# Altium schematic sheet ESP32-HWE-Dev-I2C.SchDoc
size A4; SheetNumber: 1; SheetTotal: 4
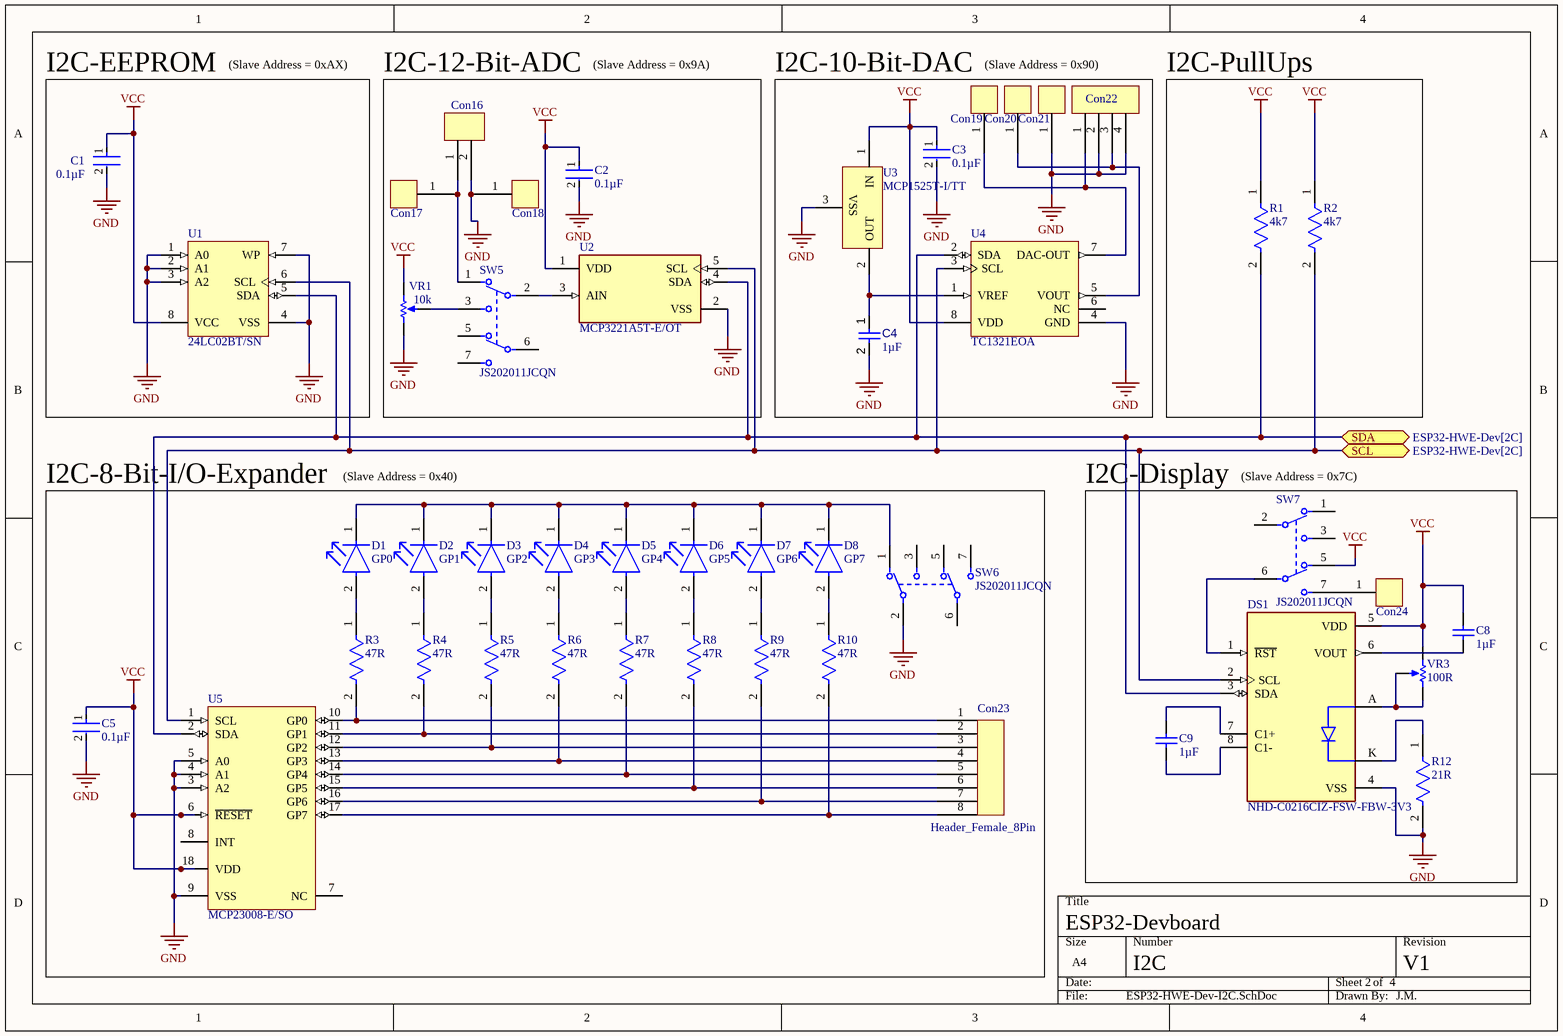
[diagram p0: ESP32-HWE-Dev-I2C.SchDoc]

## Parts
C1  0.1µF  [FP-0805-L_2_01_0_2-W_1_25-IPC_C]
C2  0.1µF  [FP-0805-L_2_01_0_2-W_1_25-IPC_C]
C3  0.1µF  [FP-0805-L_2_01_0_2-W_1_25-IPC_C]
C4  value 1µF  [CAPC2013X135X45NL10T25]  (hidden comment: Capacitor 1 uF +/- 10% 50 V 0805)
C5  0.1µF  [FP-0805-L_2_01_0_2-W_1_25-IPC_C]
C8  1µF  [CAPC2013X145X50LL20T25]
C9  1µF  [CAPC2013X145X50LL20T25]
Con16  Female 2 Pin  [Header_Female_2Pin]  (value not drawn)
Con17  Solder Nail RTM 1.3  [Solder_Nail_RTM_1.3]  (value not drawn)
Con18  Solder Nail RTM 1.3  [Solder_Nail_RTM_1.3]  (value not drawn)
Con19  I2C-DAC-DAC-Out  [Solder_Nail_RTM_1.3]  (value not drawn)
Con20  I2C-DAC-Vout  [Solder_Nail_RTM_1.3]  (value not drawn)
Con21  DAC-GND  [Solder_Nail_RTM_1.3]  (value not drawn)
Con22  Female 4 Pin  [Header_Female_4Pin]  (value not drawn)
Con23  Header_Female_8Pin  [Header_Female_8Pin]
Con24  Solder Nail RTM 1.3  [Solder_Nail_RTM_1.3]  (value not drawn)
D1  GP0  [FP-SML-LXT0805IW-TR-MFG]
D2  GP1  [FP-SML-LXT0805IW-TR-MFG]
D3  GP2  [FP-SML-LXT0805IW-TR-MFG]
D4  GP3  [FP-SML-LXT0805IW-TR-MFG]
D5  GP4  [FP-SML-LXT0805IW-TR-MFG]
D6  GP5  [FP-SML-LXT0805IW-TR-MFG]
D7  GP6  [FP-SML-LXT0805IW-TR-MFG]
D8  GP7  [FP-SML-LXT0805IW-TR-MFG]
DS1  NHD-C0216CIZ-FSW-FBW-3V3  [LCD_NHD-C0216CIZ-FSW-FBW-3V3]
R1  4k7  [FP-AC0805-MFG]
R2  4k7  [FP-AC0805-MFG]
R3  47R  [FP-AC0805-MFG]
R4  47R  [FP-AC0805-MFG]
R5  47R  [FP-AC0805-MFG]
R6  47R  [FP-AC0805-MFG]
R7  47R  [FP-AC0805-MFG]
R8  47R  [FP-AC0805-MFG]
R9  47R  [FP-AC0805-MFG]
R10  47R  [FP-AC0805-MFG]
R12  21R  [FP-AC0805-MFG]
SW5  JS202011JCQN  [FP-JS202011JCQN-MFG]
SW6  JS202011JCQN  [FP-JS202011JCQN-MFG]
SW7  JS202011JCQN  [FP-JS202011JCQN-MFG]
U1  24LC02BT/SN  [SOIC-SN8_N]
U2  MCP3221A5T-E/OT  [FP-C04-091-OT-IPC_A]
U3  MCP1525T-I/TT  [SOT-23-TT3_M]
U4  TC1321EOA  [SOIC-OA8_L]
U5  MCP23008-E/SO  [SOIC-SO18_N]
VR1  10k  [BOUR-3362P]
VR3  100R  [BOUR-3362P]

## Blocks framed on the sheet
I2C-EEPROM: C1 U1
I2C-12-Bit-ADC: C2 Con16-Con18 SW5 U2 VR1
I2C-10-Bit-DAC: C3 C4 Con19-Con22 U3 U4
I2C-PullUps: R1 R2
I2C-8-Bit-I/O-Expander: C5 Con23 D1-D8 R3-R10 SW6 U5
I2C-Display: C8 C9 Con24 DS1 R12 SW7 VR3

## Ports
SCL (bidir, see ESP32-HWE-Dev[2C]), SDA (bidir, see ESP32-HWE-Dev[2C])

## Nets
GND: C1.2 C2.2 C3.2 C4.2 C5.2 Con16.2 Con18.1 Con21.1 Con22.2 Con22.4 DS1.4(VSS) R12.2 SW6.2(1_C) U1.1(A0) U1.2(A1) U1.3(A2) U1.4(VSS) U1.7(WP) U2.2(VSS) U3.3(VSS) U4.4(GND) U5.3(A2) U5.4(A1) U5.5(A0) U5.9(VSS) VR1.1(CCW)
VCC: C1.1 C2.1 C3.1 C5.1 C8.2 DS1.5(VDD) R1.1 R2.1 SW7.5 U1.8(VCC) U2.1(VDD) U3.1(IN) U4.8(VDD) U5.6(~{RESET}) U5.18(VDD) VR1.3(CW) VR3.1(CCW)
SCL: DS1.2(SCL) R2.2 U1.6(SCL) U2.5(SCL) U4.3(SCL) U5.1(SCL) ; port SCL
SDA: DS1.3(SDA) R1.2 U1.5(SDA) U2.4(SDA) U4.2(SDA) U5.2(SDA) ; port SDA
NetC4_1: C4.1 U3.2(OUT) U4.1(VREF)
NetC8_1: C8.1 DS1.6(VOUT)
NetC9_1: C9.1 DS1.8(C1-)
NetC9_2: C9.2 DS1.7(C1+)
NetCon16_1: Con16.1 Con17.1 SW5.1
NetCon19_1: Con19.1 Con22.1 U4.7(DAC-OUT)
NetCon20_1: Con20.1 Con22.3 U4.5(VOUT)
NetCon23_1: Con23.1 R3.2 U5.10(GP0)
NetCon23_2: Con23.2 R4.2 U5.11(GP1)
NetCon23_3: Con23.3 R5.2 U5.12(GP2)
NetCon23_4: Con23.4 R6.2 U5.13(GP3)
NetCon23_5: Con23.5 R7.2 U5.14(GP4)
NetCon23_6: Con23.6 R8.2 U5.15(GP5)
NetCon23_7: Con23.7 R9.2 U5.16(GP6)
NetCon23_8: Con23.8 R10.2 U5.17(GP7)
NetCon24_1: Con24.1 SW7.7
NetD1_1: D1.1(C) D2.1(C) D3.1(C) D4.1(C) D5.1(C) D6.1(C) D7.1(C) D8.1(C) SW6.1
NetD1_2: D1.2(A) R3.1
NetD2_2: D2.2(A) R4.1
NetD3_2: D3.2(A) R5.1
NetD4_2: D4.2(A) R6.1
NetD5_2: D5.2(A) R7.1
NetD6_2: D6.2(A) R8.1
NetD7_2: D7.2(A) R9.1
NetD8_2: D8.2(A) R10.1
NetDS1_1: DS1.1(~{RST}) SW7.6(2_C)
NetDS1_A: DS1.A VR3.2(S) VR3.3(CW)
NetDS1_K: DS1.K R12.1
NetSW5_2: SW5.2(1_C) U2.3(AIN)
NetSW5_3: SW5.3 VR1.2(S)

Not connected (* = marked no-connect by the designer): SW5 5 6(2_C) 7; SW6 3 5 6(2_C) 7; SW7 1 2(1_C) 3; U4 6(NC); U5 7(NC) 8(INT)

## Notes on the sheet
- (Slave Address = 0xAX)
- (Slave Address = 0x9A)
- (Slave Address = 0x90)
- (Slave Address = 0x40)
- (near SW7) (Slave Address = 0x7C)
- ESP32-Devboard
- I2C
- 2
- 4
- V1
- J.M.

## Library data of the parts
C1-C3 C5 = CMP-2000-05016-2: General Purpose Ceramic Capacitor, 0805, 100nF, 10%, X7R, 0.15, 50V; Dissipation Factor: 2.5%; Insulation Resistance: 100GR; Voltage Rating (DC): 50V; Package Quantity: 4000; Tolerance: 10%; Voltage Rating: 50V; Dielectric: X7R; Case/Package: 0805; Lead Free: Lead Free; Dielectric Material: Ceramic; Thickness: 0.037inch; Weight: 0.001411oz; Max Operating Temperature: 125°C; REACH SVHC: No SVHC; Mount: Surface Mount; RoHS Compliant: Yes; Depth: 1.25mm; Height: 0.5mm; Case Code (Metric): 2012; Length: 2mm; Termination: Standard; Case Code (Imperial): 0805; Number of Pins: 2; Voltage: 50V; Radiation Hardening: No; Min Operating Temperature: -55°C; Capacitance: 100nF; Width: 1.2mm; Series: MLCC X7R; Packaging: Cut Tape
C4 = CMP-001-00007-6: Chip Capacitor, 1 uF, +/- 10%, 50 V, 0805 (2012 Metric); Capacitor Type: Ceramic; Voltage Rating: 50V; Min Operating Temperature: -55°C; RoHS Compliant: True; Mounting Technology: SM; Case/Package: 0805; Max Operating Temperature: 125°C; Tolerance: 10%; Pins: 2
C8 C9 = CMP-1036-04746-2: Manufacturer: Kemet; Part Number: C0805C105K4PACTU
Con16 = Header_Female_2Pin
Con17-Con21 Con24 = Solder_Nail_RTM_1.3
Con22 = Header_Female_4Pin
D1-D8 = CMP-1724-00002-2: LED RED DIFFUSED SMD; Lens Style: Rectangular; Luminous Intensity: 11mcd; Approvals: UL; Test Current: 20mA; Forward Voltage: 2V; Number of LEDs: 1; Wavelength: 635nm; Lens Color: White; Viewing Angle: 140°; Min Operating Temperature: -25°C; Case Code (Metric): 2012; Mount: Surface Mount; Case Code (Imperial): 0805; Height: 0.8mm; Lead Free: Lead Free; Color: Red; Package Quantity: 1; Illumination Color: Red; Lens Transparency: Diffused; Forward Current: 20mA; Packaging: Tape and Reel; Length: 2mm; Case/Package: 0805; REACH SVHC: No SVHC; Width: 1.25mm; Number of Pins: 2; Max Operating Temperature: 80°C; Dominant Wavelength: 635nm
DS1 = NHD-C0216CIZ-FSW-FBW-3V3: Character Display FSTN Transflective 16Char x 2Line 8-Pin; MF: {'manufacturer': u'Newhaven'}; Package: None; Price: None; Value: *; MP: NHD-C0216CIZ-FSW-FBW-3V3; Availability: Unavailable; ComponentLink1Description: Datasheet; ComponentLink1URL: https://s3.amazonaws.com/snapeda/datasheet/NHD-C0216CIZ-FSW-FBW-3V3_Newhaven.pdf
R1-R10 R12 = CMP-2001-04476-2: RES SMD 4.7K OHM 5% 1/8W 0805; Manufacturer: Yageo; Manufacturer Part Number: AC0805JR-074K7L; Tolerance: 0.05; Value: 4.7KΩ; Voltage Rating: 150V; Automotive Grade: Grade 0; ComponentLink2URL: http://www.yageo.com/documents/recent/PYu-AC_51_RoHS_L_6.pdf; Power Rating: 1/8W; Package: AC0805; Mouser Description: Thick Film Resistors - SMD 1/8W 4.7K ohm 5% AEC-Q200; Height: 0.6mm; Device Class L2: Resistors; ComponentLink2Description: Datasheet; Series: AC; RoHS: TRUE; Resistance: 4.7KΩ; Digikey Description: RES SMD 4.7K OHM 5% 1/8W 0805; Lead Free: Yes; Category: Res; Temperature Range Low: -55°C; Temperature Range High: +155°C; Composition: Thick Film; Device Class L3: Chip SMD Resistors; Device Class L1: Passive Components; Automotive: Yes; Octopart: https://octopart.com/ac0805jr-074k7l-yageo-26638632; Temperature: -55°C to +155°C; Ipc Land Pattern Name: RESC200125X50; Footprint Url: http://www.yageo.com/exep/pages/download/literatures/PYu-R_Mount_10.pdf
SW5-SW7 = CMP-10038-000009-1: SWITCH SLIDE DPDT 300MA 6V; Actuator Material: Nylon; Actuator Length: 2mm; Actuator Type: Standard; Electrical Life: 5000Cycles; Switch Function: On-On; Mount: Surface Mount; Current Rating: 300mA; Contact Material: Copper Alloy; Voltage Rating (DC): 6V; Throw Configuration: DPDT; Packaging: Cut Tape; Contact Plating: Silver; Min Operating Temperature: -40°C; Switch Travel: 2mm; Max Operating Temperature: 85°C
U1 = CMP-0159-00324-1: 2Kbit, 400kHz, 2.5V, I2C Serial EEPROM, 8-Pin SOIC 150mil, Commercial Temperature, Tape and Reel; Code_JEDEC: MS-012; PackageVersion: revBB, Aug-2009; DatasheetVersion: revJ, Feb-2009; PackageDescription: 8-Lead Plastic Small Outline (SN) - Narrow, 3.90mm Body [SOIC]; PackageReference: SOIC-SN8; Code_IPC: SOIC127P600-8
U2 = CMP-0188-00729-3: IC ADC 12BIT SAR SOT23-5; Number of Bits: 12; Number of Analog Inputs: 1; Min Supply Voltage: 2.7V; Integral Nonlinearity (INL): 2LSB; Sampling Rate: 22.3KS/s; Polarity: Unipolar; Interface: I2C; Max Supply Voltage: 5.5V; Resolution: 12b; Nominal Supply Current: 175uA; REACH SVHC: No SVHC; Packaging: Tape and Reel; Height: 1.3mm; Number of Channels: 1; Max Operating Temperature: 125°C; Mount: Surface Mount; Width: 1.8mm; Lead Free: Lead Free; Length: 3.1mm; Number of A/D Converters: 1; Number of Inputs: 1; Case/Package: SOT-23; Package Quantity: 3000; Conversion Rate: 22.3KS/s; Number of Converters: 1; Number of Elements: 1; Min Operating Temperature: -40°C; Number of Pins: 5; Termination: SMD/SMT; Radiation Hardening: No
U3 = CMP-0131-00003-1: 2.5V Voltage Reference, 3-Pin SOT-23, Industrial Temperature, Tape and Reel; DatasheetVersion: revB, Feb-2005; Code_IPC: SOT23-3; PackageDescription: 3-Lead Plastic Small Outline Transistor (TT) [SOT-23]; PackageReference: SOT-23-TT3; PackageVersion: revBB, Aug-2009
U4 = CMP-0188-00049-2: 10-Bit Digital-to-Analog Converter with Two-Wire Interface, 8-Pin SOIC 150mil, Extended Temperature; ComponentLink3URL: http://www.microchip.com/stellent/groups/techpub_sg/documents/packagingspec/en012702.pdf; ComponentLink2Description: Datasheet; ComponentLink1Description: Manufacturer URL; Code_IPC: SOIC127P600-8; ComponentLink2URL: http://ww1.microchip.com/downloads/en/DeviceDoc/21387C.pdf; PackageReference: SOIC-OA8; RevisionNote: URLs added. DatasheetVersion updated.; ComponentLink1URL: http://www.microchip.com/; DatasheetVersion: revC, Nov-2010; PackageVersion: revBB, Aug-2009; PackageDescription: 8-Lead Plastic Small Outline (OA) - Narrow, 3.90mm Body [SOIC]; ComponentLink3Description: Package Specification
U5 = CMP-0186-00050-2: 8-Bit I/O Expander with Serial Interface, 18-Pin SOIC, Extended Temperature; PackageDescription: 18-Lead Plastic Small Outline (SO) - Wide 7.50mm Body [SOIC]; ComponentLink3Description: Package Specification; ComponentLink2Description: Datasheet; ComponentLink2URL: http://ww1.microchip.com/downloads/en/DeviceDoc/21919e.pdf; RevisionNote: URLs added.; ComponentLink1URL: http://www.microchip.com/; ComponentLink3URL: http://www.microchip.com/stellent/groups/techpub_sg/documents/packagingspec/en012702.pdf; ComponentLink1Description: Manufacturer URL; PackageReference: SOIC-SO18; DatasheetVersion: revE, Aug-2007; PackageVersion: revBB, Aug-2009; Code_JEDEC: MS-013
VR1 VR3 = CMP-1747-00004-1: Square Trimpot(R) Trimming Potentiometer, 10 KOhm, 300 V, -55 to 125 degC, 3-Pin THD, RoHS, Tube; Voltage Rating: 220 mV; Power Rating: 1 W; Tolerance: 1%; Resistance: 50 mohm; Case/Package: 1206; Length: 3.2 mm; RoHSCompliant: True; PackageDescription: 3-Pin Through Hole Device, Body 6.6 x 6.99 mm, Pitch 2.54 mm; ComponentLink2Description: Datasheet; REACH SVHC: No SVHC; Mount: Surface Mount; Height: 0.6 mm; Packaging: Tape and Reel; ComponentLink1URL: http://www.bourns.com/; Case Code (Imperial): 0612; Pins: 2; Case Code (Metric): 1632; ComponentLink2URL: http://www.bourns.com/docs/Product-Datasheets/3362.pdf; Min Operating Temperature: -25degC; ComponentLink1Description: Manufacturer URL; PackageReference: 3326P; Max Operating Temperature: 125degC; Width: 1.6 mm; Package Quantity: 5000; DatasheetVersion: May-16